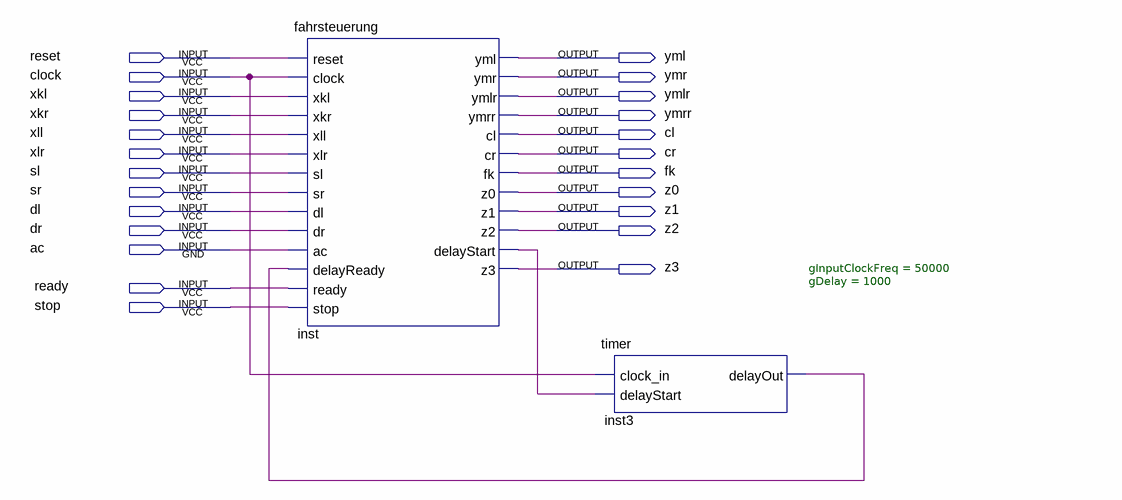
[diagram p0: schematic sheet]
// Quartus schematic fahrsteuerung_Block.bdf as structural Verilog: 2 symbols, 24 pins
module fahrsteuerung_Block (
  input  reset,
  input  clock,
  input  xkl,
  input  xkr,
  input  xll,
  input  xlr,
  input  sl,
  input  sr,
  input  dl,
  input  dr,
  input  ac,
  input  ready,
  input  stop,
  output yml,
  output ymr,
  output ymlr,
  output ymrr,
  output cl,
  output cr,
  output fk,
  output z0,
  output z1,
  output z2,
  output z3
);

  wire inst3_delayout, inst_delaystart;

  fahrsteuerung inst (
    .reset(reset), .clock(clock), .xkl(xkl), .xkr(xkr), .xll(xll), .xlr(xlr), .sl(sl), .sr(sr), .dl(dl),
    .dr(dr), .ac(ac), .delayReady(inst3_delayout), .ready(ready), .stop(stop), .yml(yml), .ymr(ymr),
    .ymlr(ymlr), .ymrr(ymrr), .cl(cl), .cr(cr), .fk(fk), .z0(z0), .z1(z1), .z2(z2),
    .delayStart(inst_delaystart), .z3(z3));
  timer #(.gInputClockFreq(50000), .gDelay(1000)) inst3 (
    .clock_in(clock), .delayStart(inst_delaystart), .delayOut(inst3_delayout));
endmodule
